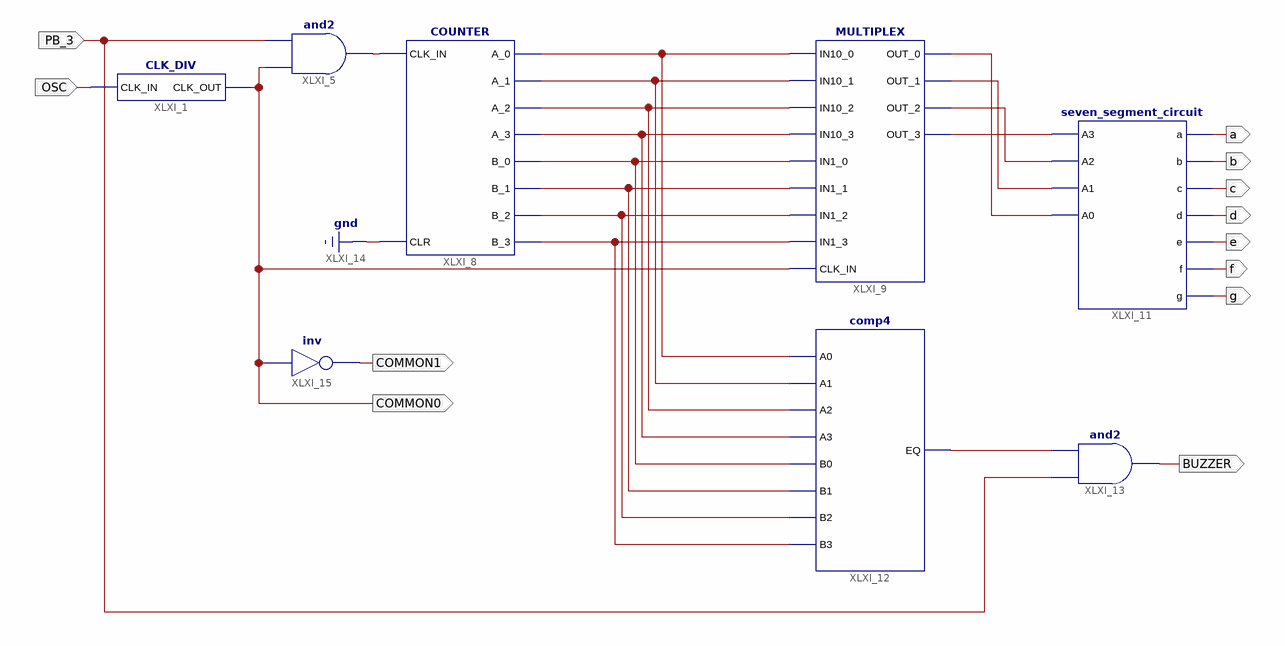
[diagram p0: schematic sheet 1]
// Xilinx ISE schematic main.sch (spartan6) as structural Verilog: 8 symbols, 12 ports
module main (
  input  OSC,
  input  PB_3,
  output COMMON0,
  output a,
  output b,
  output c,
  output d,
  output e,
  output f,
  output g,
  output BUZZER,
  output COMMON1
);

  wire XLXN_16, XLXN_49, XLXN_50, XLXN_51, XLXN_52, XLXN_63, XLXN_64, XLXN_65, XLXN_66, XLXN_67, XLXN_68,
       XLXN_69, XLXN_70, XLXN_71;

  CLK_DIV XLXI_1 (.CLK_IN(OSC), .CLK_OUT(COMMON0));
  and XLXI_5 (XLXN_16, COMMON0, PB_3);
  COUNTER XLXI_8 (
    .CLK_IN(XLXN_16), .CLR(1'b0), .A_0(XLXN_63), .A_1(XLXN_64), .A_2(XLXN_65), .A_3(XLXN_66), .B_0(XLXN_67),
    .B_1(XLXN_68), .B_2(XLXN_69), .B_3(XLXN_70));
  MULTIPLEX XLXI_9 (
    .CLK_IN(COMMON0), .IN10_0(XLXN_63), .IN10_1(XLXN_64), .IN10_2(XLXN_65), .IN10_3(XLXN_66),
    .IN1_0(XLXN_67), .IN1_1(XLXN_68), .IN1_2(XLXN_69), .IN1_3(XLXN_70), .OUT_0(XLXN_52), .OUT_1(XLXN_51),
    .OUT_2(XLXN_50), .OUT_3(XLXN_49));
  seven_segment_circuit XLXI_11 (
    .a(a), .A0(XLXN_52), .A1(XLXN_51), .A2(XLXN_50), .A3(XLXN_49), .b(b), .c(c), .d(d), .e(e), .f(f), .g(g));
  comp4 XLXI_12 (
    .A0(XLXN_63), .A1(XLXN_64), .A2(XLXN_65), .A3(XLXN_66), .B0(XLXN_67), .B1(XLXN_68), .B2(XLXN_69),
    .B3(XLXN_70), .EQ(XLXN_71));
  and XLXI_13 (BUZZER, PB_3, XLXN_71);
  not XLXI_15 (COMMON1, COMMON0);

  // Notes on the sheet:
  //   LOC on signal OSC = P123
  //   LOC on signal PB_3 = P47
  //   LOC on signal COMMON0 = P44
  //   LOC on signal a = P41
  //   LOC on signal b = P40
  //   LOC on signal c = P35
  //   LOC on signal d = P34
  //   LOC on signal e = P32
  //   LOC on signal f = P29
  //   LOC on signal g = P27
  //   LOC on signal BUZZER = P43
  //   LOC on signal COMMON1 = P43
endmodule
